# EAGLE design Block M (EAGLE 9.1.1)
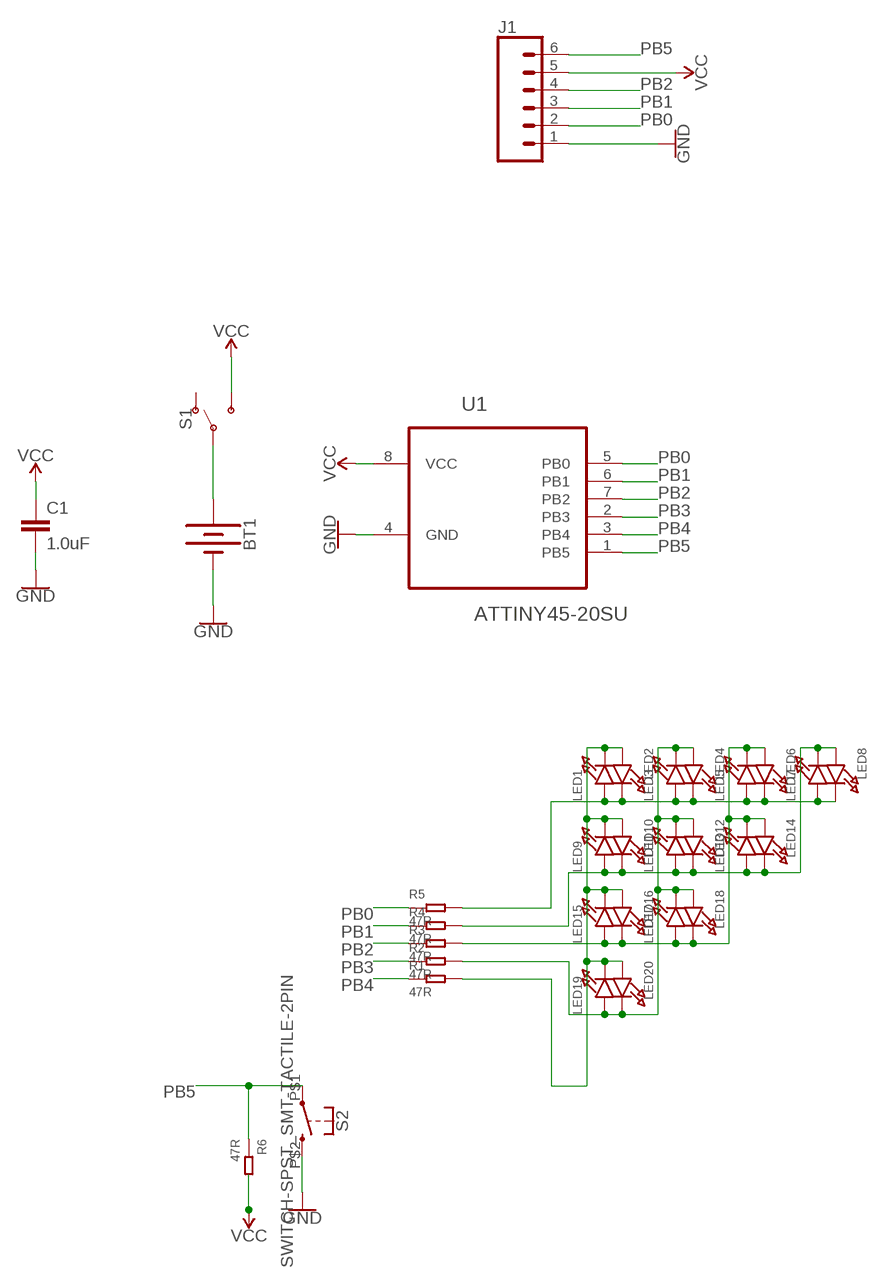
[diagram p0: schematic, sheet 1]

## Parts
BT1  BATTERY-12MM_SMD_ALT  [BATTCON_12MM_ALT]
C1  1.0uF  1.0UF-0805-25V-10%  [0805]
J1  CONN_06SMD-FEMALE-NO-SILK  [1X06-SMD-FEMALE_NO_SILK]
LED1  LED0805_NOOUTLINE  [CHIPLED_0805_NOOUTLINE]
LED2  LED0805_NOOUTLINE  [CHIPLED_0805_NOOUTLINE]
LED3  LED0805_NOOUTLINE  [CHIPLED_0805_NOOUTLINE]
LED4  LED0805_NOOUTLINE  [CHIPLED_0805_NOOUTLINE]
LED5  LED0805_NOOUTLINE  [CHIPLED_0805_NOOUTLINE]
LED6  LED0805_NOOUTLINE  [CHIPLED_0805_NOOUTLINE]
LED7  LED0805_NOOUTLINE  [CHIPLED_0805_NOOUTLINE]
LED8  LED0805_NOOUTLINE  [CHIPLED_0805_NOOUTLINE]
LED9  LED0805_NOOUTLINE  [CHIPLED_0805_NOOUTLINE]
LED10  LED0805_NOOUTLINE  [CHIPLED_0805_NOOUTLINE]
LED11  LED0805_NOOUTLINE  [CHIPLED_0805_NOOUTLINE]
LED12  LED0805_NOOUTLINE  [CHIPLED_0805_NOOUTLINE]
LED13  LED0805_NOOUTLINE  [CHIPLED_0805_NOOUTLINE]
LED14  LED0805_NOOUTLINE  [CHIPLED_0805_NOOUTLINE]
LED15  LED0805_NOOUTLINE  [CHIPLED_0805_NOOUTLINE]
LED16  LED0805_NOOUTLINE  [CHIPLED_0805_NOOUTLINE]
LED17  LED0805_NOOUTLINE  [CHIPLED_0805_NOOUTLINE]
LED18  LED0805_NOOUTLINE  [CHIPLED_0805_NOOUTLINE]
LED19  LED0805_NOOUTLINE  [CHIPLED_0805_NOOUTLINE]
LED20  LED0805_NOOUTLINE  [CHIPLED_0805_NOOUTLINE]
R1  47R  SMD-RES-47R-5%-1/8W(0805)  [R0805]
R2  47R  SMD-RES-47R-5%-1/8W(0805)  [R0805]
R3  47R  SMD-RES-47R-5%-1/8W(0805)  [R0805]
R4  47R  SMD-RES-47R-5%-1/8W(0805)  [R0805]
R5  47R  SMD-RES-47R-5%-1/8W(0805)  [R0805]
R6  47R  SMD-RES-47R-5%-1/8W(0805)  [R0805]
S1  SWITCH-SPDT-SMD-RIGHT-ANGLE  [SWITCH_SPST_SMD_A]
S2  SWITCH-SPST_SMT-TACTILE-2PIN  [SMT_TACTILE_SWITCH_3X2MM]
U1  ATTINY45-20SU  [SOIC127P798X216-8N]

## Nets
GND: BT1.GND(-) C1.2 J1.1 S2.P$2 U1.4(GND)
N$1: LED1.A LED2.C LED3.A LED4.C LED5.A LED6.C LED7.A LED8.C R5.2
N$2: BT1.PWR@2(+) S1.2(P)
N$8: LED3.C LED4.A LED11.C LED12.A LED17.C LED18.A LED19.A LED20.C R2.2
N$9: LED5.C LED6.A LED13.C LED14.A LED15.A LED16.C LED17.A LED18.C R3.2
N$11: LED1.C LED2.A LED9.C LED10.A LED15.C LED16.A LED19.C LED20.A R1.2
N$15: LED7.C LED8.A LED9.A LED10.C LED11.A LED12.C LED13.A LED14.C R4.2
PB0: J1.2 R5.1 U1.5(PB0)
PB1: J1.3 R4.1 U1.6(PB1)
PB2: J1.4 R3.1 U1.7(PB2)
PB3: R2.1 U1.2(PB3)
PB4: R1.1 U1.3(PB4)
PB5: J1.6 R6.1 S2.P$1 U1.1(PB5)
VCC: C1.1 J1.5 R6.2 S1.3(S) U1.8(VCC)
Unconnected: S1.1(O)

## Library data of the parts
BT1 = SparkFun-Batteries:BATTERY: Battery - Single Cell A variety of battery chemistries, sizes, and footprints. Device List: 20MM_PTH - Coin Cell Battery Holder - 20mm (PTH) <https://www.sparkfun.com/products/783> 12MM_SMD - Coin Cell Battery Holder - 12mm (SMD) <https://www.sparkfun.com/products/10592> 12MM_PTH - Coin Cell Battery Holder - 12mm (PTH) <https://www.sparkfun.com/products/7948> 20MM_SMD - 20mm Coin Cell Battery Holder (SMD) (2 legs) Used on the Big Time Watch Kit <https://www.sparkfun.com/products/11734> 20MM_SMD_4LEGS - Coin Cell Battery Holder - 20mm (SMD) <https://www.sparkfun.com/products/11892> 20MM_SMD_4LEGS_OVERPASTE - Coin Cell Battery Holder - 20mm (SMD) <https://www.sparkfun.com/products/11892> (Over-paste on the legs) 24.5MM_PTH - Coin Cell Battery Holder - 24.5mm (PTH) <https://www.sparkfun.com/products/8863> 9V - 9V Battery Holder - PC Mount Used on the SparkFun SparkPunk Sound Kit <https://www.sparkfun.com/products/11177> and SparkFun SparkPunk Sequencer Kit <https://www.sparkfun.com/products/12707> 18650 - Battery Holder - 18650 (PTH) <https://www.sparkfun.com/products/13113> AA - Battery Holder - 1xAA (PTH) <https://www.sparkfun.com/products/7949> AAA - Battery Holder - 1xAAA (PTH) <https://www.sparkfun.com/products/12718> AA_KIT - Battery Holder - 1xAA (PTH) <https://www.sparkfun.com/products/7949> Special kit package - pads only have exposed copper on one side of the board. AAA_KIT - Battery Holder - 1xAAA (PTH) <https://www.sparkfun.com/products/12718> Special kit package - pads only have exposed copper on one side of the board.
C1 = SparkFun-Capacitors:1.0UF: 1µF ceramic capacitors A capacitor is a passive two-terminal electrical component used to store electrical energy temporarily in an electric field.; PROD_ID: CAP-08064
J1 = SparkFun-Connectors:CONN_06: Multi connection point. Often used as Generic Header-pin footprint for 0.1 inch spaced/style header connections On any of the 0.1 inch spaced packages, you can populate with these: Break Away Headers - Straight <https://www.sparkfun.com/products/116> (PRT-00116) Break Away Male Headers - Right Angle <https://www.sparkfun.com/products/553> (PRT-00553) Female Headers <https://www.sparkfun.com/products/115> (PRT-00115) Break Away Headers - Machine Pin <https://www.sparkfun.com/products/117> (PRT-00117) Break Away Female Headers - Swiss Machine Pin <https://www.sparkfun.com/products/743> (PRT-00743) Arduino Stackable Header - 6 Pin <https://www.sparkfun.com/products/9280> (PRT-09280) For SCREWTERMINALS and SPRING TERMINALS visit here: Screw Terimnals on SparkFun.com <https://www.sparkfun.com/search/results?term=Screw+Terminals> (5mm/3.5mm/2.54mm spacing) This device is also useful as a general connection point to wire up your design to another part of your project. Our various solder wires solder well into these plated through hole pads. Hook-Up Wire - Assortment (Stranded, 22 AWG) <https://www.sparkfun.com/products/11375> (PRT-11375) Hook-Up Wire - Assortment (Solid Core, 22 AWG) <https://www.sparkfun.com/products/11367> (PRT-11367) View the entire wire category on our website here <https://www.sparkfun.com/categories/141>
LED1-LED20 = microbuilder:LED: LED 0603 - 0603 Surface Mount Package 2mA: Green LED - Low Power (3.9mcd, 2ma, 1.7Vf) - Digikey: 475-2709-2-ND Orange LED - Low Power (9.8mcd, 2ma, 1.8Vf) - Digikey: 475-1194-2-ND Red LED - Low Power (5mcd, 2ma, 1.8Vf) - Digikey: 475-1195-2-ND Yellow LED - Low Power (7mcd, 2ma, 1.8Vf) - Digikey: 475-1196-2-ND 5mA: Blue LED - Low Power (17mcd, 5ma, 2.9Vf) - Digikey: LNJ937W8CRACT-ND 0805 - 0805 Surface Mount Package 2mA: Red LED (8.8mcd, 2mA, 1.8Vf, Clear) - Low Power [Digikey: 475-2510-1-ND] Green LED (5mcd, 2mA, 1.8Vf, Clear) - Low Power [Digikey: 475-2730-1-ND] Yellow LED (11.3mcd, 2mA, 1.8Vf, Clear) - Low Power [Digikey: 475-2555-1-ND] 20mA: Red LED (104mcd, 20mA, Diffused) - LS R976 [Digikey: 475-1278-6-ND] Red LED (12mcd, 20mA, 2.0Vf, Clear) - APT2012EC [Digikey: 754-1128-1-ND] Green LED (15mcd, 20mA, 2.2Vf, Clear) - APT2012GC [Digikey: 754-1131-1-ND] Orange LED (160mcd, 20mA, 2.1Vf, Clear) - APT2012SECK [Digikey: 754-1130-1-ND] 1206 - 1206 Surface Mount Package Green LED (26mcd, 20mA, Diffused) - LG N971 [Digikey: 475-1407-6-ND] Red LED (15mcd, 20mA, Diffused) - LH N974 [Digikey: 475-1416-6-ND]
R1-R6 = Seeed-OPL-Resistor:SMD-RES-47R-5%-1/8W(0805): 301010380; MPN: RC0805JR-0747RL
S1 = SparkFun-Switches:SWITCH-SPDT: Single Pole, Double Throw (SPDT) Switch Single-pole, double-throw (SPDT) switch. Variant Overview SMD-AYZ0202 Surface Mount DPDT Switch <https://www.sparkfun.com/products/597> (COM-00597) Used on e.g. LilyPad Arduino USB - ATmega32U4 Board <https://www.sparkfun.com/products/12049> PTH-11.6X4.0MM SPDT Mini Power Switch <https://www.sparkfun.com/products/102> (COM-00102) Used on e.g. SparkFun Simon Says - Through-Hole Soldering Kit <https://www.sparkfun.com/products/10547> (KIT-10547) PTH-11.6X4.0MM-KIT KIT version of SPDT Mini Power Switch - Simplifies soldering by removing tStop of switch pins - only one side can be soldered. PTH-11.6X4.0MM-LOCK LOCK version of SPDT Mini Power Switch - Offset pins hold switch in place for easier soldering. SMD-RIGHT-ANGLE Surface Mount Right Angle Switch <https://www.sparkfun.com/products/10860> (COM-10860) Used on e.g. SparkFun ESP8266 Thing <https://www.sparkfun.com/products/13231>; PROD_ID: SWCH-10651; SF_SKU: COM-10860
S2 = !CustomParts:SWITCH-SPST_SMT-TACTILE-2PIN
U1 = Atmel_By_element14_Batch_1-00:ATTINY45-20SU: 8-bit Microcontroller with 4 Bytes In-System Programmable Flash; MPN: ATTINY45-20SU; OC_FARNELL: 1288353; OC_NEWARK: 23M5073; PACKAGE: SOIC-8; SUPPLIER: Atmel

## Board
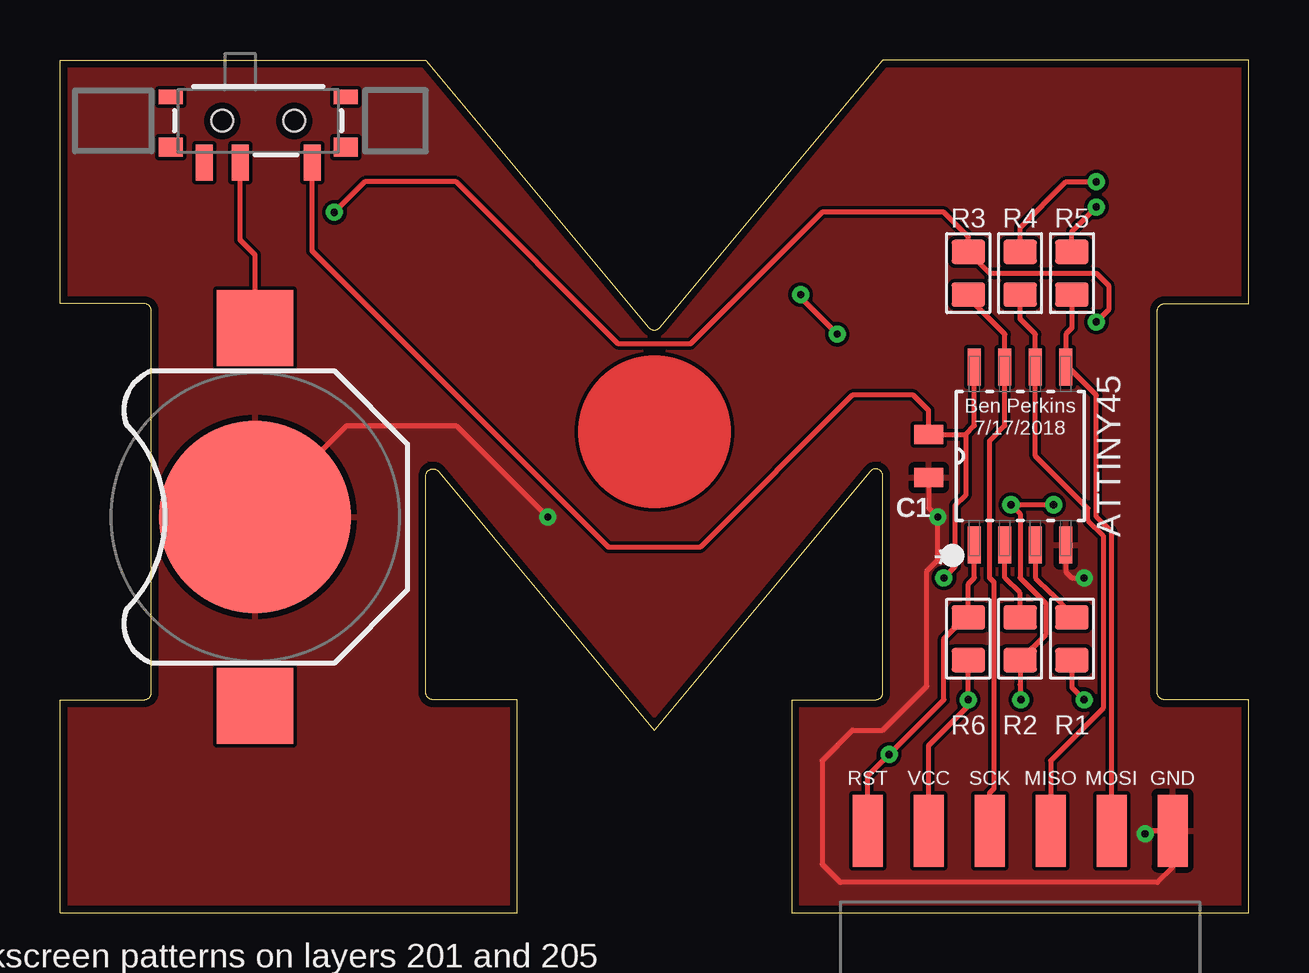
[diagram p1: board, top side]
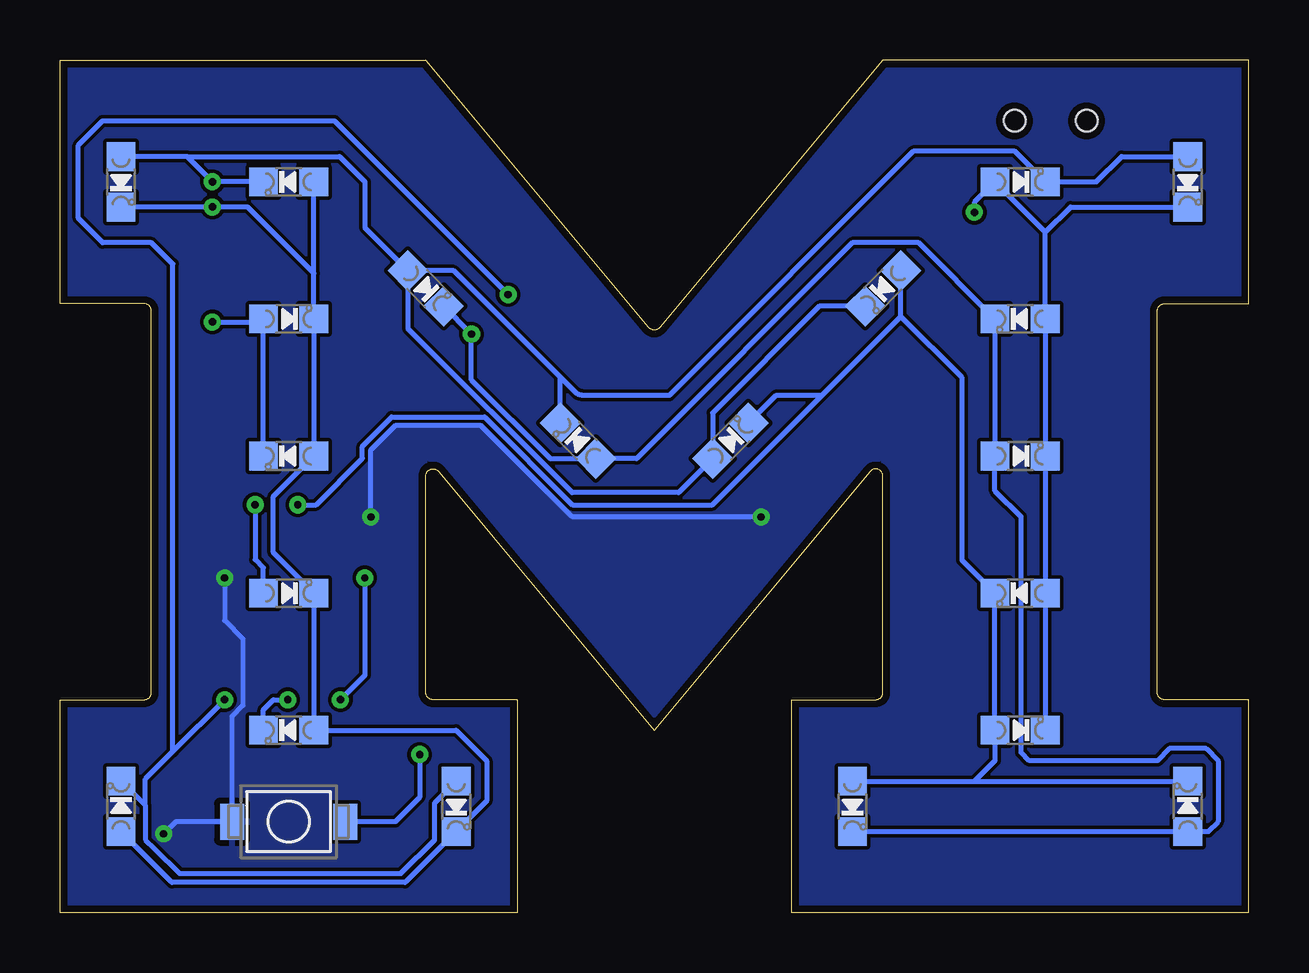
[diagram p2: board, bottom side, seen from below]

Size 49.53 x 35.56 mm. Coordinates in mm from the lower left corner, seen from the top.
Outline: 0,0 19.05,0 19.05,8.89 15.54,8.89 arc-90 15.24,9.2 15.24,18.21 arc-140 15.78,18.4 24.77,7.62 33.75,18.4 arc-140 34.29,18.21 34.29,9.2 arc-90 33.98,8.89 30.48,8.89 30.48,0 49.53,0 49.53,8.89 46.02,8.89 arc-90 45.72,9.2 45.72,25.09 arc-90 46.02,25.4 49.53,25.4 49.53,35.56 34.29,35.56 25,24.41 arc-100 24.53,24.41 15.24,35.56 0,35.56 0,25.4 3.5,25.4 arc-90 3.81,25.09 3.81,9.2 arc-90 3.5,8.89 0,8.89 0,0
Copper layers (1*16): Top 0.035mm / dielectric 1.5mm / Bottom 0.035mm
Design rules "default *": minimum track width 6mil, minimum drill 0.35mm, track to track 6mil, track to pad 8mil, pad to pad 8mil, via to via 10mil, smd to smd 6mil, copper to edge 12mil, drill to drill 6mil, minimum pad ring 10mil, minimum via ring 8mil, stop-mask expansion 4mil, vias tented up to drill 13mil, thermal gap 10mil

### Footprints (pad centres in the part's own frame; a part is rotated, then mirrored left to right if it is on the bottom)
BATTCON_12MM_ALT = smd 8 x 8: GND 0,0 | smd 3.175 x 3.175: PWR@1 -7.874,0; PWR@2 7.874,0
0805 = smd 0.8 x 1.2: 1 -0.9,0; 2 0.9,0
1X06-SMD-FEMALE_NO_SILK = smd 1.25 x 3: 1 6.35,3.425; 2 3.81,3.425; 3 1.27,3.425; 4 -1.27,3.425; 5 -3.81,3.425; 6 -6.35,3.425
CHIPLED_0805_NOOUTLINE = smd 1.2 x 1.2: A 0,-1.05; C 0,1.05
R0805 = smd 1.397 x 1.016: 1 0,0.889; 2 0,-0.889
SWITCH_SPST_SMD_A = smd 0.7 x 1.5: 1 -2.25,-1.75; 2 -0.75,-1.75; 3 2.25,-1.75 | smd 1 x 0.6: GND1 -3.65,1; GND3 3.65,1 | smd 1 x 0.8: GND2 -3.65,-1.1; GND4 3.65,-1.1 | hole 0.9: -1.5,0; 1.5,0
SMT_TACTILE_SWITCH_3X2MM = smd 1 x 1.5: P$1 -2.35,0; P$2 2.35,0
SOIC127P798X216-8N = smd 1.549 x 0.533: 1 -3.708,1.905; 2 -3.708,0.635; 3 -3.708,-0.635; 4 -3.708,-1.905; 5 3.708,-1.905; 6 3.708,-0.635; 7 3.708,0.635; 8 3.708,1.905

### Placement (x,y rotation side)
BT1  8.13,16.51 90 top
C1  36.2,19.05 270 top
J1  40.01,0 0 top
LED1  46.99,4.45 0 bottom
LED2  33.02,4.45 180 bottom
LED3  40.01,7.62 90 bottom
LED4  40.01,13.34 270 bottom
LED5  40.01,19.05 90 bottom
LED6  40.01,24.77 270 bottom
LED7  40.01,30.48 90 bottom
LED8  46.99,30.48 180 bottom
LED9  34.29,26.04 225 bottom
LED10  27.94,19.68 45 bottom
LED11  21.59,19.68 315 bottom
LED12  15.24,26.04 135 bottom
LED13  2.54,30.48 180 bottom
LED14  9.53,30.48 270 bottom
LED15  9.53,24.77 90 bottom
LED16  9.53,19.05 270 bottom
LED17  9.53,13.34 90 bottom
LED18  9.53,7.62 270 bottom
LED19  16.51,4.45 180 bottom
LED20  2.54,4.45 0 bottom
R1  42.16,11.43 0 top
R2  40.01,11.43 0 top
R3  37.85,26.67 180 top
R4  40.01,26.67 180 top
R5  42.16,26.67 180 top
R6  37.85,11.43 0 top
S1  8.26,33.02 0 top
S2  40.01,3.81 180 bottom
U1  40.01,19.05 90 top

### Tracks (layer width: path | path; a pad name or v marks a point on that pad's centre or on a via)
GND  (via drill 0.3)
  Top 0.203: BT1.GND 11.94,20.32 16.51,20.32 v20.32,16.51 | v45.21,3.3 45.34,3.42 J1.1 46.35,1.91 45.72,1.27 32.51,1.27 31.75,2.03 31.75,6.35 33.02,7.62 34.29,7.62 36.12,9.45 36.12,14.27 36.58,14.72 v36.58,16.51 36.2,16.89 C1.2 | U1.4 41.91,14.22 42.16,13.97 v42.67,13.97
  Bottom 0.203: v45.21,3.3 44.7,3.81 S2.P$2 42.35,8.2 41.91,8.65 41.91,11.43 42.67,12.19 v42.67,13.97 | v36.58,16.51 36.58,19.3 35.56,20.32 31.99,20.32 28.18,16.51 v20.32,16.51
  pour Bottom: 0,0 0,8.89 3.81,8.89 3.81,25.4 0,25.4 0,35.56 15.24,35.56 24.77,24.26 34.29,35.56 49.53,35.56 49.53,25.4 45.72,25.4 45.72,8.89 49.53,8.89 49.53,0 30.48,0 30.48,8.89 34.29,8.89 34.29,19.05 24.77,7.62 15.24,19.05 15.24,8.89 19.05,8.89 19.05,0
  pour Top: 0,0 0,8.89 3.81,8.89 3.81,25.4 0,25.4 0,35.56 15.24,35.56 24.77,24.26 34.29,35.56 49.53,35.56 49.53,25.4 45.72,25.4 45.72,8.89 49.53,8.89 49.53,0 30.48,0 30.48,8.89 34.29,8.89 34.29,19.05 24.77,7.62 15.24,19.05 15.24,8.89 19.05,8.89 19.05,0
N$1  (via drill 0.3)
  Top 0.203: R5.2 42.16,28.41 v43.18,29.43
  Bottom 0.203: LED1.A 44.87,1.27 35.15,1.27 LED2.C 31.75,4.67 31.75,6.35 33.02,7.62 LED3.A LED4.C 40.64,15.02 40.64,17.36 LED5.A LED6.C 38.95,26.67 | 38.95,26.67 LED7.A | 38.95,26.67 41.72,29.43 v43.18,29.43 LED8.C
N$2
  Top 0.203: BT1.PWR@2 8.13,27.43 7.5,28.05 S1.2
N$8  (via drill 0.3)
  Top 0.203: R2.2 40.01,9.53 | R2.2 40.01,8.92 v40.04,8.89 | v41.4,17.02 v39.62,17.02 40.01,16.64 40.01,13.97 41.08,12.89 41.08,11.62 R2.2
  Bottom 0.203: LED19.A 11.43,5.5 | 11.43,5.5 LED20.C | 11.43,5.5 10.57,6.35 LED18.A LED17.C 11.94,14.7 11.94,22.31 14.5,24.87 | 14.5,24.87 LED12.A | 17.78,21.59 22.35,17.02 28.18,17.02 31.84,20.68 35.71,20.68 36.93,19.45 36.93,18.95 38.86,17.02 v39.62,17.02 | 17.78,21.59 14.5,24.87 | LED4.A 41.05,14.38 41.4,14.73 v41.4,17.02 | LED11.C 19.68,21.59 17.78,21.59 | LED3.C 41.05,8.47 40.64,8.89 v40.04,8.89
N$9  (via drill 0.3)
  Top 0.203: v11.43,29.21 12.7,30.48 16.51,30.48 23.27,23.72 26.26,23.72 31.75,29.21 36.83,29.21 37.85,28.19 R3.2 38.73,26.67 43.18,26.67 43.69,26.16 43.69,25.15 v43.18,24.64
  Bottom 0.203: LED5.C LED6.A 41.18,24.64 v43.18,24.64 | LED18.C LED17.A LED16.C LED15.A 8.47,28.38 | 8.47,28.38 LED14.A 11.43,29.62 v11.43,29.21 | 8.47,28.38 7.42,29.43 LED13.C
N$11  (via drill 0.3)
  Top 0.203: R1.2 42.16,9.4 v42.67,8.89 | v32.38,24.13 30.86,25.65 v30.86,25.78
  Bottom 0.203: LED19.C LED20.A 1.69,3.4 1.27,3.81 1.27,6.35 1.78,6.86 3.3,6.86 3.81,6.35 9.14,6.35 9.49,6.69 9.49,16.51 10.57,17.6 LED16.A LED15.C 13.75,27.94 16.51,27.94 25.51,18.94 LED10.A 27.94,18.94 29.1,18.94 32.38,22.23 v32.38,24.13 LED9.C | 46.99,5.03 LED1.C 45.97,4.48 | v42.67,8.89 44.83,6.73 | 44.83,6.73 45.97,5.59 45.97,4.48 | 44.83,6.73 44.83,27.05 45.72,27.94 47.75,27.94 48.77,28.96 48.77,32 47.75,33.02 38.1,33.02 v30.86,25.78 | LED2.A 33.92,4.59 33.92,3.05 35.32,1.65 44.54,1.65 45.59,2.67 45.97,3.06 45.97,4.48
N$15  (via drill 0.3)
  Top 0.203: R4.2 40.01,28.57 41.91,30.48 v43.18,30.48
  Bottom 0.203: LED13.A 5.3,31.53 6.35,30.48 LED14.C 9.74,31.75 13.97,31.75 24.13,21.59 27.77,21.59 arc45 28.06,21.71 28.68,22.33 | LED12.C 17.89,25.29 22.33,20.85 LED11.A 23.75,17.53 28.19,17.53 35.03,24.37 LED9.A | LED10.C 28.68,22.33 | LED9.A 33.13,26.78 28.68,22.33 | LED7.C v43.18,30.48 44.23,31.53 | 44.23,31.53 LED8.A | LED9.A 36.83,28.57 36.83,30.48 37.88,31.53 44.23,31.53
PB0
  Top 0.203: J1.2 43.81,15.88 43.18,16.51 43.18,21.59 42.01,22.76 U1.5 41.91,24.13 42.16,24.38 R5.1
PB1
  Top 0.203: J1.3 41.27,6.35 43.46,8.53 43.46,15.73 42.82,16.36 42.82,16.87 40.64,19.05 U1.6 40.64,24.13 40.01,24.77 R4.1
PB2
  Top 0.203: R3.1 38.1,25.4 39.37,24.13 U1.7 39.37,20.32 38.73,19.68 38.73,13.97 38.92,13.78 38.92,5.19 38.73,5 J1.4
PB3
  Top 0.203: R2.1 40.01,13.34 39.37,13.97 U1.2
PB4
  Top 0.203: U1.3 40.64,13.97 41.27,13.34 42.16,12.45 R1.1
PB5  (via drill 0.3)
  Top 0.203: U1.1 38.1,13.97 37.85,13.72 R6.1 37.72,12.32 36.83,11.43 36.83,8.89 v34.54,6.6 33.66,5.71 J1.6
  Bottom 0.203: S2.P$1 35.56,3.81 34.54,4.83 v34.54,6.6
VCC  (via drill 0.3)
  Top 0.203: J1.5 36.2,6.99 37.85,8.64 v37.85,8.89 R6.2 | 37.73,19.95 C1.1 36.2,20.95 35.56,21.59 33.02,21.59 26.67,15.24 22.86,15.24 10.51,27.59 S1.3 | 37.73,19.95 38.1,20.32 U1.8 | 37.73,19.95 37.73,17.41 37.29,16.97 37.29,14.43 v36.83,13.97
  Bottom 0.203: v36.83,13.97 36.83,9.91 v37.85,8.89
(copper drawn outside any net)
  shapes: Top circle x1

### Text on the board
tPlace: Ben Perkins / 7/17/2018
tNames: ATTINY45 | RST | VCC | SCK | MISO | MOSI | GND | Silkscreen patterns on layers 201 and 205
tDocu: OFF | ON